# EAGLE board OSSIComms (EAGLE 6.1)
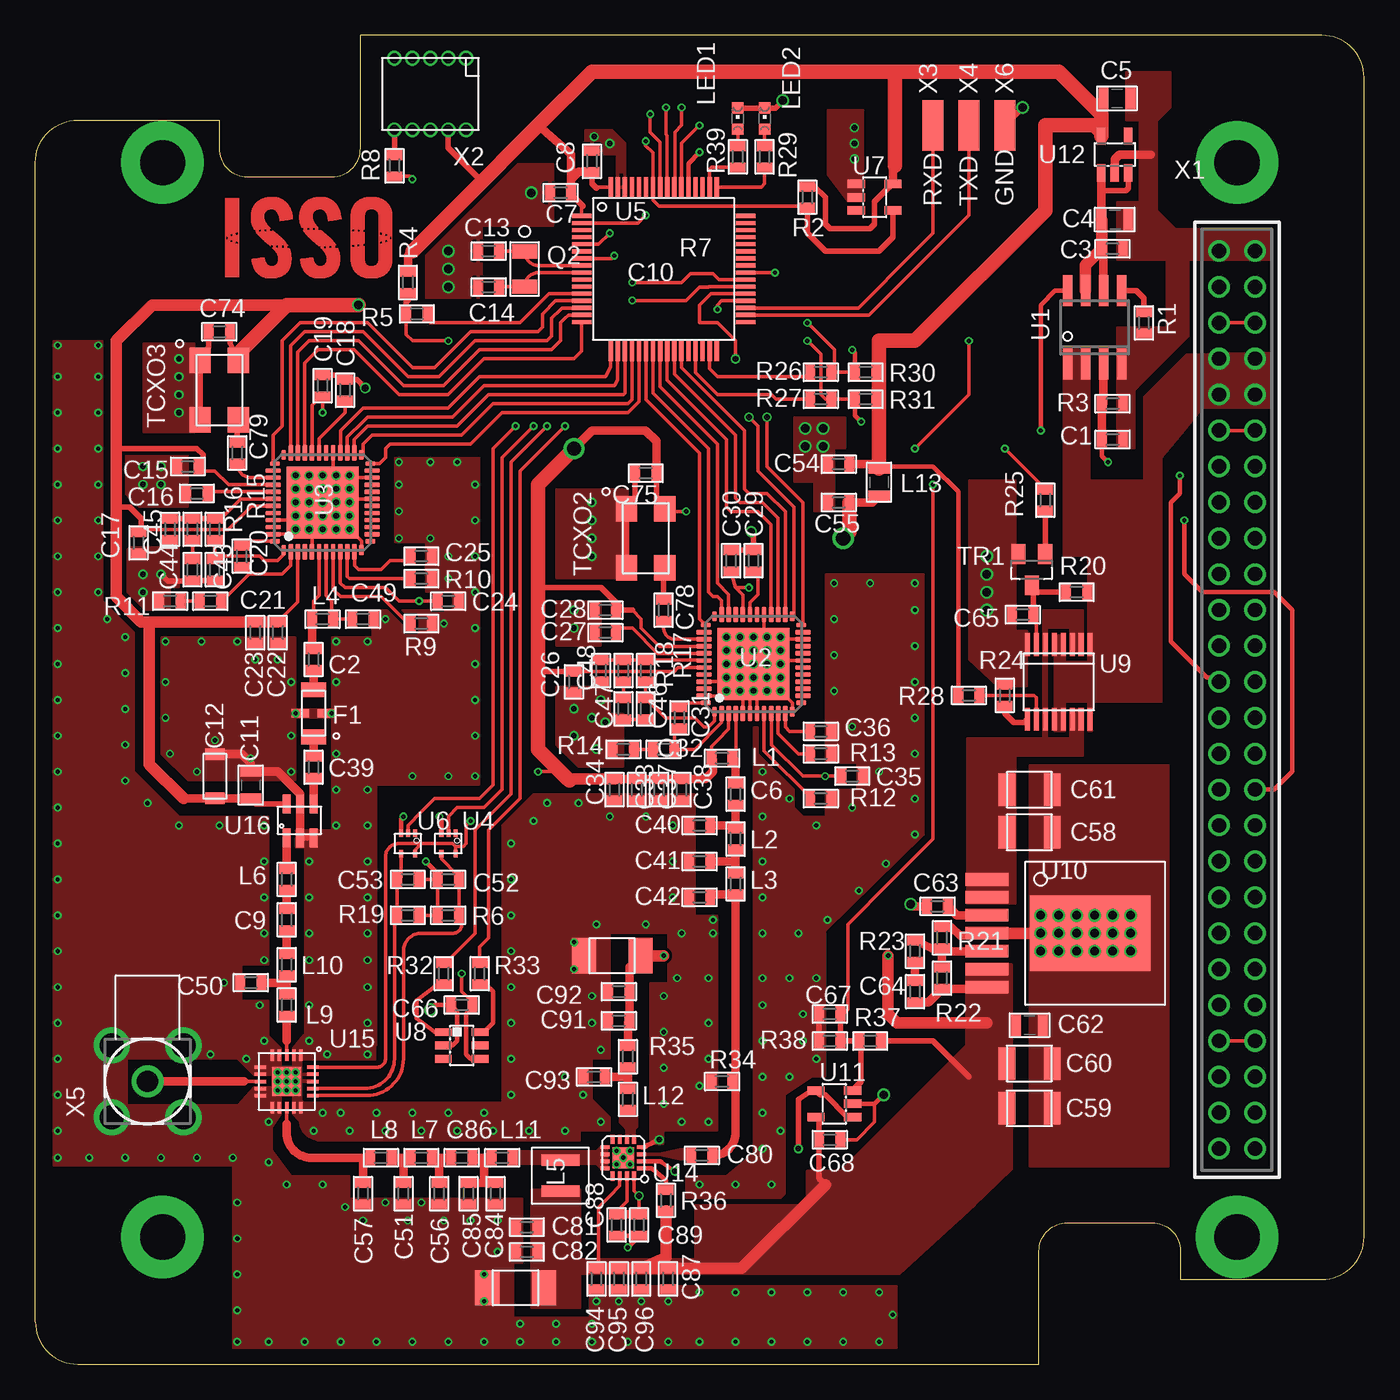
[diagram p4: board, top side]
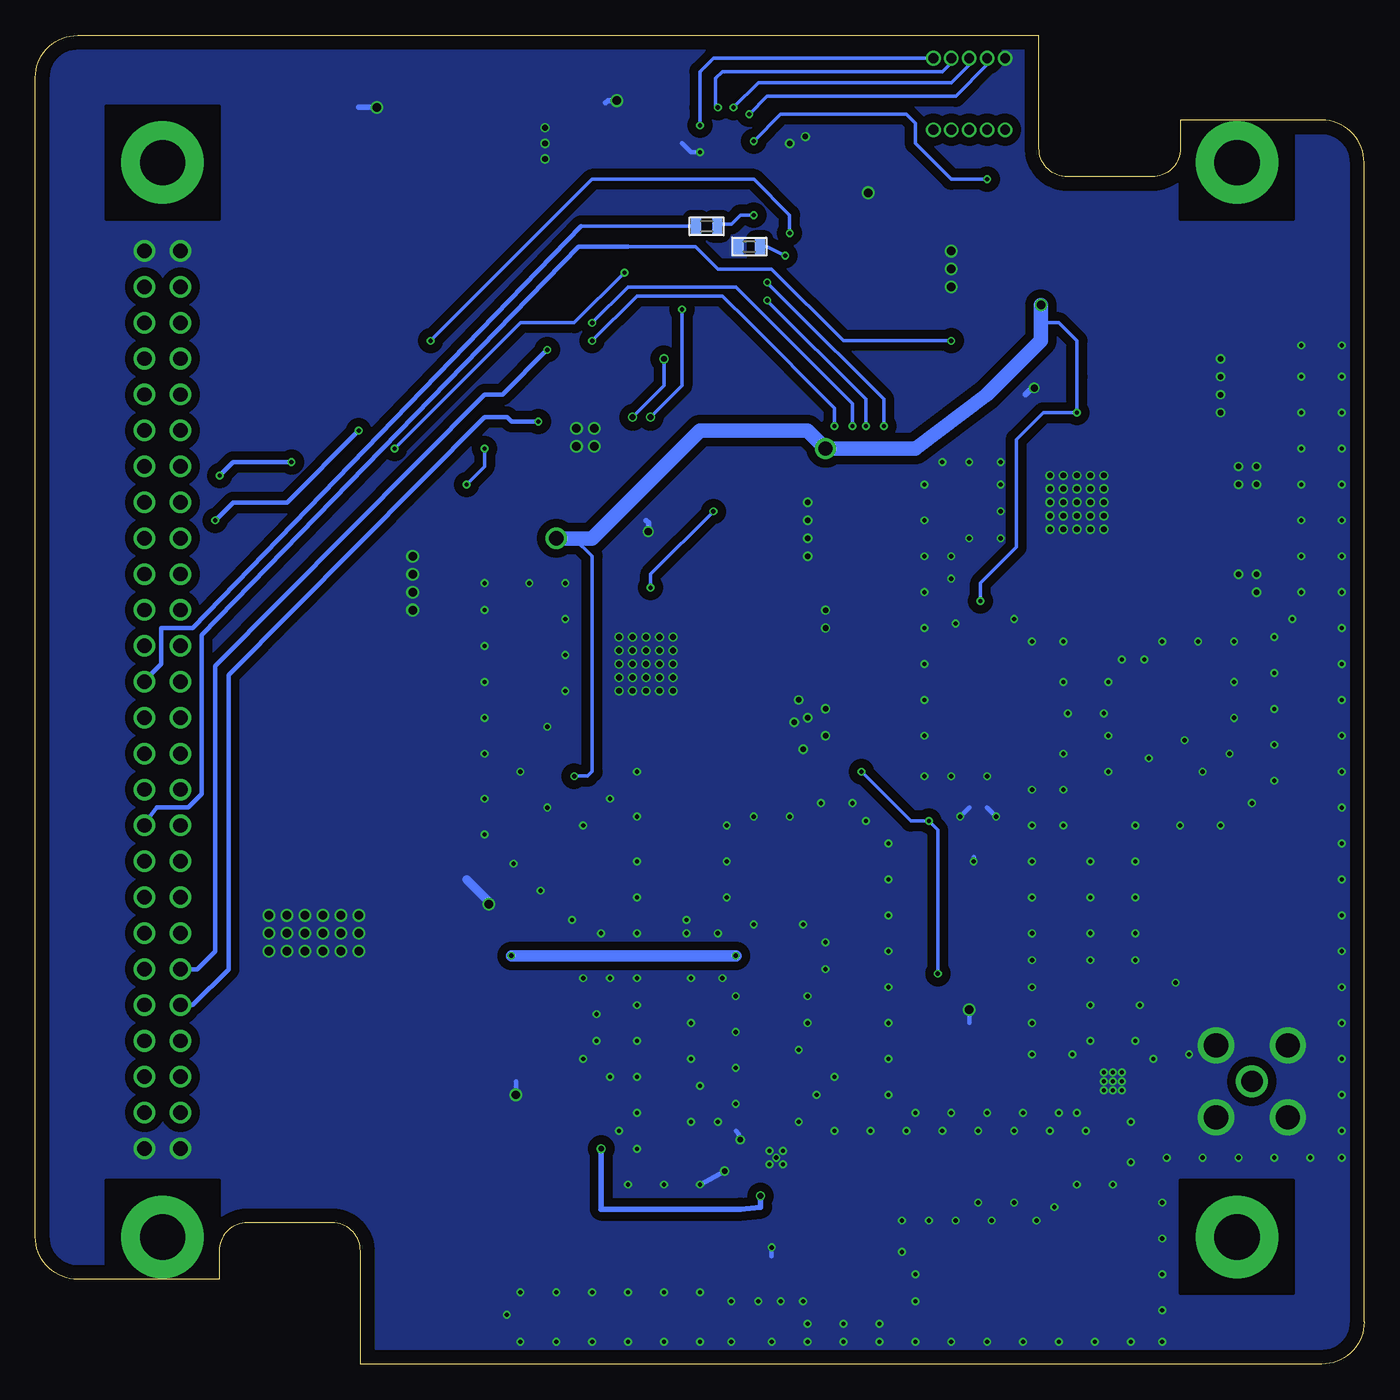
[diagram p5: board, bottom side, seen from below]

Size 94 x 94 mm. Coordinates in mm from the lower left corner, seen from the top.
Outline: 0,3 0,85 arc-90 3,88 13,88 13,86 arc90 15,84 21,84 arc90 23,86 23,94 91,94 arc-90 94,91 94,9 arc-90 91,6 81,6 81,8 arc90 79,10 73,10 arc90 71,8 71,0 3,0 arc-90 0,3
Copper layers (1*16): Top 0.035mm / dielectric 1.5mm / Bottom 0.035mm
Design rules: minimum track width 10mil, minimum drill 5mil, track to track 8mil, track to pad 8mil, pad to pad 8mil, via to via 8mil, smd to smd 8mil, copper to edge 40mil, drill to drill 8mil, minimum pad ring 5mil, minimum via ring 5mil, stop-mask expansion 4mil, vias tented up to drill 0mil, thermal gap 10mil

## Footprints (pad centres in the part's own frame; a part is rotated, then mirrored left to right if it is on the bottom)
C0603(1608) = smd 0.7 x 1.1: 1 -0.75,0; 2 0.75,0
C0805(2012) = smd 0.7 x 1.5: 1 -0.95,0; 2 0.95,0
C1206-GCM31 = smd 0.8 x 1.4: P$1 -1.55,0; P$2 1.55,0
C1210-GCM32 = smd 1.2 x 2.3: P$1 -1.6,0; P$2 1.6,0
C1210-TMK325 = smd 1.7 x 2.5: P$1 -2,0; P$2 2,0
LFCN = smd 1.045 x 1.8: 1 -1.675,0; 3 1.675,0 | smd 0.61 x 1.25: 2 0,-0.925; 4 0,0.925
3.2-PAD-ROUND = drill 3.2 pad 5.842: B3,2 0,0
L0603(1608) = smd 0.7 x 1.1: 1 -0.75,0; 2 0.75,0
NR3012 = smd 0.8 x 2.7: P$1 -1.1,0; P$2 1.1,0
L0805(2012) = smd 0.7 x 1.5: 1 -0.95,0; 2 0.95,0
CHIPLED_0603 = smd 0.8 x 0.8: A 0,-0.75; C 0,0.75
NX-3215 = smd 1 x 1.8: 1 -1.25,0; 2 1.25,0
R0603(1608) = smd 0.7 x 1.1: 1 -0.75,0; 2 0.75,0
TCXO_M532 = smd 1.8 x 1.5: 1 -2.1,-1.35; 2 2.1,-1.35; 3 2.1,1.35; 4 -2.1,1.35
SOT23 = smd 1 x 1.4: 1 -0.95,-1.1; 2 0.95,-1.1; 3 0,1.1
SO8 = smd 0.65 x 2.2: 1 -1.905,-2.6; 2 -0.635,-2.6; 3 0.635,-2.6; 4 1.905,-2.6; 5 1.905,2.6; 6 0.635,2.6; 7 -0.635,2.6; 8 -1.905,2.6
LFCSP48 = smd 0.7 x 0.32: 1 -3.375,2.75; 12 -3.375,-2.75; 25 3.375,-2.75; 36 3.375,2.75 | smd 1.1 x 0.32: 2 -3.5,2.25; 3 -3.5,1.75; 4 -3.5,1.25; 5 -3.5,0.75; 6 -3.5,0.25; 7 -3.5,-0.25; 8 -3.5,-0.75; 9 -3.5,-1.25; 10 -3.5,-1.75; 11 -3.5,-2.25; 26 3.5,-2.25; 27 3.5,-1.75; 28 3.5,-1.25; 29 3.5,-0.75; 30 3.5,-0.25; 31 3.5,0.25; 32 3.5,0.75; 33 3.5,1.25; 34 3.5,1.75; 35 3.5,2.25 | smd 0.32 x 0.7: 13 -2.75,-3.375; 24 2.75,-3.375; 37 2.75,3.375; 48 -2.75,3.375 | smd 0.32 x 1.1: 14 -2.25,-3.5; 15 -1.75,-3.5; 16 -1.25,-3.5; 17 -0.75,-3.5; 18 -0.25,-3.5; 19 0.25,-3.5; 20 0.75,-3.5; 21 1.25,-3.5; 22 1.75,-3.5; 23 2.25,-3.5; 38 2.25,3.5; 39 1.75,3.5; 40 1.25,3.5; 41 0.75,3.5; 42 0.25,3.5; 43 -0.25,3.5; 44 -0.75,3.5; 45 -1.25,3.5; 46 -1.75,3.5; 47 -2.25,3.5 | smd 5.1 x 5.1: EXP 0,0
SOT-553 = smd 0.3 x 0.55: 1 -0.515,-0.725; 2 -0.015,-0.725; 3 0.485,-0.725; 4 0.485,0.725; 5 -0.515,0.725
PM/PAG64 = smd 1.4 x 0.3: 1 -5.8,3.75; 2 -5.8,3.25; 3 -5.8,2.75; 4 -5.8,2.25; 5 -5.8,1.75; 6 -5.8,1.25; 7 -5.8,0.75; 8 -5.8,0.25; 9 -5.8,-0.25; 10 -5.8,-0.75; 11 -5.8,-1.25; 12 -5.8,-1.75; 13 -5.8,-2.25; 14 -5.8,-2.75; 15 -5.8,-3.25; 16 -5.8,-3.75; 33 5.8,-3.75; 34 5.8,-3.25; 35 5.8,-2.75; 36 5.8,-2.25; 37 5.8,-1.75; 38 5.8,-1.25; 39 5.8,-0.75; 40 5.8,-0.25; 41 5.8,0.25; 42 5.8,0.75; 43 5.8,1.25; 44 5.8,1.75; 45 5.8,2.25; 46 5.8,2.75; 47 5.8,3.25; 48 5.8,3.75 | smd 0.3 x 1.4: 17 -3.75,-5.8; 18 -3.25,-5.8; 19 -2.75,-5.8; 20 -2.25,-5.8; 21 -1.75,-5.8; 22 -1.25,-5.8; 23 -0.75,-5.8; 24 -0.25,-5.8; 25 0.25,-5.8; 26 0.75,-5.8; 27 1.25,-5.8; 28 1.75,-5.8; 29 2.25,-5.8; 30 2.75,-5.8; 31 3.25,-5.8; 32 3.75,-5.8; 49 3.75,5.8; 50 3.25,5.8; 51 2.75,5.8; 52 2.25,5.8; 53 1.75,5.8; 54 1.25,5.8; 55 0.75,5.8; 56 0.25,5.8; 57 -0.25,5.8; 58 -0.75,5.8; 59 -1.25,5.8; 60 -1.75,5.8; 61 -2.25,5.8; 62 -2.75,5.8; 63 -3.25,5.8; 64 -3.75,5.8
SOT23-5DBV = smd 0.6 x 1.22: 1 -0.95,-1.3; 2 0,-1.3; 3 0.95,-1.3; 4 0.95,1.3; 5 -0.95,1.3
SOT23-6DBV = smd 0.55 x 1.2: 1 -0.95,-1.3; 2 0,-1.3; 3 0.95,-1.3; 4 0.95,1.3; 5 0,1.3; 6 -0.95,1.3
16QSOP = smd 1.6 x 0.356: 1 -2.65,2.223; 2 -2.65,1.587; 3 -2.65,0.953; 4 -2.65,0.318; 5 -2.65,-0.318; 6 -2.65,-0.953; 7 -2.65,-1.587; 8 -2.65,-2.223; 9 2.65,-2.223; 10 2.65,-1.587; 11 2.65,-0.953; 12 2.65,-0.318; 13 2.65,0.318; 14 2.65,0.953; 15 2.65,1.587; 16 2.65,2.223
TO-PMOD-7 = smd 0.89 x 3.06: 1 -3.81,0; 2 -2.54,0; 3 -1.27,0; 4 0,0; 5 1.27,0; 6 2.54,0; 7 3.81,0 | smd 5.35 x 8.54: PAD 0,7.305
RF5110G = smd 0.64 x 0.28: 1 -1.3,0.75; 2 -1.3,0.25; 3 -1.3,-0.25; 4 -1.3,-0.75; 9 1.3,-0.75; 10 1.3,-0.25; 11 1.3,0.25; 12 1.3,0.75 | smd 0.28 x 0.64: 5 -0.75,-1.3; 6 -0.25,-1.3; 7 0.25,-1.3; 8 0.75,-1.3; 13 0.75,1.3; 14 0.25,1.3; 15 -0.25,1.3; 16 -0.75,1.3 | smd 1.5 x 1.5: TPAD 0,0
DG983-1 = smd 0.81 x 0.25: 1 -1.85,1; 2 -1.85,0.5; 3 -1.85,0; 4 -1.85,-0.5; 5 -1.85,-1; 11 1.85,-1; 12 1.85,-0.5; 13 1.85,0; 14 1.85,0.5; 15 1.85,1 | smd 0.25 x 0.81: 6 -1,-1.85; 7 -0.5,-1.85; 8 0,-1.85; 9 0.5,-1.85; 10 1,-1.85; 16 1,1.85; 17 0.5,1.85; 18 0,1.85; 19 -0.5,1.85; 20 -1,1.85 | smd 2.06 x 2.06: PAD 0,0
SOT23-6 = smd 0.56 x 1.33: 1 -0.95,-1.2; 2 0,-1.2; 3 0.95,-1.2; 4 0.95,1.2; 5 0,1.2; 6 -0.95,1.2
ESQ-126-XX-X-D = drill 1.016 pad 1.524: 1 -1.27,31.75; 2 1.27,31.75; 3 -1.27,29.21; 4 1.27,29.21; 5 -1.27,26.67; 6 1.27,26.67; 7 -1.27,24.13; 8 1.27,24.13; 9 -1.27,21.59; 10 1.27,21.59; 11 -1.27,19.05; 12 1.27,19.05; 13 -1.27,16.51; 14 1.27,16.51; 15 -1.27,13.97; 16 1.27,13.97; 17 -1.27,11.43; 18 1.27,11.43; 19 -1.27,8.89; 20 1.27,8.89; 21 -1.27,6.35; 22 1.27,6.35; 23 -1.27,3.81; 24 1.27,3.81; 25 -1.27,1.27; 26 1.27,1.27; 27 -1.27,-1.27; 28 1.27,-1.27; 29 -1.27,-3.81; 30 1.27,-3.81; 31 -1.27,-6.35; 32 1.27,-6.35; 33 -1.27,-8.89; 34 1.27,-8.89; 35 -1.27,-11.43; 36 1.27,-11.43; 37 -1.27,-13.97; 38 1.27,-13.97; 39 -1.27,-16.51; 40 1.27,-16.51; 41 -1.27,-19.05; 42 1.27,-19.05; 43 -1.27,-21.59; 44 1.27,-21.59; 45 -1.27,-24.13; 46 1.27,-24.13; 47 -1.27,-26.67; 48 1.27,-26.67; 49 -1.27,-29.21; 50 1.27,-29.21; 51 -1.27,-31.75; 52 1.27,-31.75
M50-3200545 = drill 0.7 pad 1: 1 -2.54,-2.54; 2 -2.54,2.54; 3 -1.27,-2.54; 4 -1.27,2.54; 5 0,-2.54; 6 0,2.54; 7 1.27,-2.54; 8 1.27,2.54; 9 2.54,-2.54; 10 2.54,2.54
P-PAD-S = smd 3.556 x 1.5: 1 0,0
MCX-R/A = drill 1.5: 1 0,0 | drill 1.7: 2 -2.54,2.54; 3 2.54,2.54; 4 2.54,-2.54; 5 -2.54,-2.54

## Placement (x,y rotation side)
C1  1uF  [C0603(1608)]  76.2,65.41 0 top
C2  13pF  [C0603(1608)]  19.68,49.85 270 top
C3  100nF  [C0603(1608)]  76.2,78.9 0 top
C4  1uF 0805  [C0805(2012)]  76.36,80.96 0 top
C5  1uF 0805  [C0805(2012)]  76.52,89.53 0 top
C6  13pF  [C0603(1608)]  49.53,40.32 270 top
C7  100nF  [C0603(1608)]  37.15,82.87 180 top
C8  100nF  [C0603(1608)]  39.37,85.09 90 top
C9  1500pF  [C0603(1608)]  17.78,31.43 270 top
C10  100nF  [C0603(1608)]  43.5,79.06 180 bottom
C11  470pF 0805  [C0805(2012)]  15.24,40.96 90 top
C12  10uF  [C1206-GCM31]  12.7,41.59 90 top
C13  12.5pF  [C0603(1608)]  32.07,78.74 180 top
C14  12.5pF  [C0603(1608)]  32.07,76.2 180 top
C15  10nF  [C0603(1608)]  10.79,63.5 180 top
C16  100nF  [C0603(1608)]  11.43,61.59 180 top
C17  10nF  [C0603(1608)]  7.3,58.1 270 top
C18  100nF  [C0603(1608)]  21.91,68.9 90 top
C19  10nF  [C0603(1608)]  20.32,69.22 90 top
C20  22nF  [C0603(1608)]  14.61,57.15 270 top
C21  100nF  [C0603(1608)]  12.38,53.98 180 top
C22  100nF  [C0603(1608)]  17.14,51.75 270 top
C23  100pF  [C0603(1608)]  15.56,51.75 270 top
C24  100nF  [C0603(1608)]  29.21,53.98 0 top
C25  100nF  [C0603(1608)]  27.3,57.15 0 top
C26  10nF  [C0603(1608)]  38.1,48.26 270 top
C27  100nF  [C0603(1608)]  40.32,51.75 180 top
C28  10nF  [C0603(1608)]  40.32,53.34 180 top
C29  100nF  [C0603(1608)]  50.8,56.83 90 top
C30  10nF  [C0603(1608)]  49.21,56.83 90 top
C31  22nF  [C0603(1608)]  45.56,45.72 270 top
C32  100nF  [C0603(1608)]  44.45,43.5 180 top
C33  100nF  [C0603(1608)]  42.55,40.64 270 top
C34  100pF  [C0603(1608)]  40.96,40.64 270 top
C35  100nF  [C0603(1608)]  57.78,41.59 0 top
C36  100nF  [C0603(1608)]  55.56,44.77 0 top
C37  100nF  [C0603(1608)]  44.13,40.64 270 top
C38  100pF  [C0603(1608)]  45.72,40.64 270 top
C39  15pF  [C0603(1608)]  19.68,42.23 270 top
C40  8.2pF  [C0603(1608)]  46.99,38.1 180 top
C41  12pF  [C0603(1608)]  46.99,35.56 180 top
C42  8.2pF  [C0603(1608)]  46.99,33.02 180 top
C43  1.2nF  [C0603(1608)]  12.7,56.2 270 top
C44  100nF  [C0603(1608)]  11.11,56.2 270 top
C45  10nF  [C0603(1608)]  9.53,59.05 270 top
C46  1.2nF  [C0603(1608)]  43.18,46.35 270 top
C47  100nF  [C0603(1608)]  41.59,46.35 270 top
C48  10nF  [C0603(1608)]  40.01,49.05 270 top
C49  6.8pF  [C0603(1608)]  23.18,52.7 0 top
C50  DNP  [C0603(1608)]  15.24,26.99 180 top
C51  DNP  [C0603(1608)]  26.04,12.06 90 top
C52  100pF  [C0603(1608)]  29.21,34.29 180 top
C53  100pF  [C0603(1608)]  26.35,34.29 0 top
C54  10nF  [C0603(1608)]  56.83,63.66 180 top
C55  100nF  [C0603(1608)]  56.83,60.96 180 top
C56  DNP  [C0603(1608)]  28.57,12.06 90 top
C57  DNP  [C0603(1608)]  23.18,12.06 90 top
C58  [C1210-GCM32]  70.33,37.62 0 top
C59  [C1210-GCM32]  70.33,18.1 0 top
C60  [C1210-GCM32]  70.33,21.27 0 top
C61  [C1210-GCM32]  70.33,40.64 0 top
C62  [C0805(2012)]  70.33,23.97 0 top
C63  10nF  [C0603(1608)]  63.82,32.38 180 top
C64  180pF  [C0603(1608)]  62.23,26.35 90 top
C65  100nF  [C0603(1608)]  69.85,53.02 180 top
C66  100nF  [C0603(1608)]  30.16,25.4 180 top
C67  100nF  [C0603(1608)]  56.2,24.77 180 top
C68  100nF  [C0603(1608)]  56.2,15.88 0 top
C74  10nF  [C0603(1608)]  13.02,73.03 180 top
C75  10nF  [C0603(1608)]  43.18,63.02 180 top
C78  22pF  [C0603(1608)]  44.45,53.34 270 top
C79  22pF  [C0603(1608)]  14.29,64.45 270 top
C80  8.2pF  [C0603(1608)]  47.15,14.76 180 top
C81  47pF  [C0603(1608)]  34.77,9.68 180 top
C82  1nF  [C0603(1608)]  34.77,7.94 180 top
C83  3.3uF  [C1210-TMK325]  33.97,5.4 180 top
C84  22pF  [C0603(1608)]  32.54,12.06 270 top
C85  2pF  [C0603(1608)]  30.64,12.06 270 top
C86  56pF  [C0603(1608)]  30.16,14.61 180 top
C87  10nF  [C0603(1608)]  44.77,6.03 90 top
C88  10nF  [C0603(1608)]  41.12,9.84 90 top
C89  10nF  [C0603(1608)]  42.7,9.84 90 top
C90  3.3uF  [C1210-TMK325]  40.8,28.89 180 top
C91  1nF  [C0603(1608)]  41.27,24.29 180 top
C92  10pF  [C0603(1608)]  41.27,26.35 180 top
C93  15pF  [C0603(1608)]  39.53,20.32 180 top
C94  330pF  [C0603(1608)]  39.69,6.03 270 top
C95  1nF  [C0603(1608)]  41.27,6.03 270 top
C96  10nF  [C0603(1608)]  42.86,6.03 270 top
F1  LFCN-160  [LFCN]  19.68,46.04 90 top
H1  MOUNT-PAD-ROUND3.2  [3.2-PAD-ROUND]  9,9 0 top
H2  MOUNT-PAD-ROUND3.2  [3.2-PAD-ROUND]  9,85 0 top
H3  MOUNT-PAD-ROUND3.2  [3.2-PAD-ROUND]  85,9 0 top
H4  MOUNT-PAD-ROUND3.2  [3.2-PAD-ROUND]  85,85 0 top
L1  26nH  [L0603(1608)]  48.58,42.86 180 top
L2  11nH  [L0603(1608)]  49.53,37.15 270 top
L3  11nH  [L0603(1608)]  49.53,33.97 270 top
L4  27nH  [L0603(1608)]  20.32,52.7 180 top
L5  39nH 3012, 1A rating  [NR3012]  37.15,13.34 270 top
L6  47nH  [L0603(1608)]  17.78,34.29 270 top
L7  [L0603(1608)]  27.3,14.61 180 top
L8  [L0603(1608)]  24.45,14.61 180 top
L9  [L0603(1608)]  17.78,25.4 270 top
L10  [L0603(1608)]  17.78,28.26 270 top
L11  3.9nH  [L0603(1608)]  33.02,14.61 180 top
L12  1.5nH  [L0603(1608)]  41.91,18.73 270 top
L13  0 Ohm  [L0805(2012)]  59.69,62.39 270 top
LED1  [CHIPLED_0603]  49.69,88.11 0 top
LED2  [CHIPLED_0603]  51.59,88.11 0 top
Q2  NX-3215  [NX-3215]  34.61,77.47 270 top
R1  TBD  [R0603(1608)]  78.42,73.66 90 top
R2  100k  [R0603(1608)]  54.61,82.55 90 top
R3  100k  [R0603(1608)]  76.2,67.94 180 top
R4  470k  [R0603(1608)]  26.35,76.52 90 top
R5  4.7k  [R0603(1608)]  26.99,74.3 180 top
R6  10k  [R0603(1608)]  29.21,31.75 0 top
R7  1.5k  [R0603(1608)]  46.51,80.49 180 bottom
R8  4.7k  [R0603(1608)]  25.4,84.77 270 top
R9  1.1k  [R0603(1608)]  27.3,52.39 0 top
R10  3.6k  [R0603(1608)]  27.3,55.56 0 top
R11  3.9  [R0603(1608)]  9.53,53.98 0 top
R12  1.1k  [R0603(1608)]  55.56,40.01 180 top
R13  3.6k  [R0603(1608)]  55.56,43.18 180 top
R14  3.9  [R0603(1608)]  41.59,43.5 0 top
R15  280  [R0603(1608)]  12.7,59.05 90 top
R16  100  [R0603(1608)]  11.11,59.05 90 top
R17  280  [R0603(1608)]  43.18,49.05 90 top
R18  100  [R0603(1608)]  41.59,49.05 90 top
R19  10k  [R0603(1608)]  26.35,31.75 180 top
R20  100k  [R0603(1608)]  73.66,54.61 0 top
R21  23.7k  [R0603(1608)]  64.14,30.16 90 top
R22  75k  [R0603(1608)]  64.14,27.3 90 top
R23  1.1k  [R0603(1608)]  62.23,29.21 90 top
R24  TBD  [R0603(1608)]  68.58,47.31 270 top
R25  1.5k  [R0603(1608)]  71.44,61.12 90 top
R26  250  [R0603(1608)]  55.56,70.17 180 top
R27  250  [R0603(1608)]  55.56,68.26 180 top
R28  100k  [R0603(1608)]  66.04,47.31 0 top
R29  1k  [R0603(1608)]  51.59,85.41 90 top
R30  10k  [R0603(1608)]  58.74,70.17 0 top
R31  10k  [R0603(1608)]  58.74,68.26 0 top
R32  250  [R0603(1608)]  28.89,27.62 270 top
R33  250  [R0603(1608)]  31.43,27.62 270 top
R34  180  [R0603(1608)]  48.58,20 0 top
R35  330nH  [R0603(1608)]  41.91,21.75 270 top
R36  11nH  [R0603(1608)]  44.61,11.59 270 top
R37  22k  [R0603(1608)]  59.05,22.86 180 top
R38  100k  [R0603(1608)]  56.2,22.86 180 top
R39  1k  [R0603(1608)]  49.69,85.41 90 top
TCXO2  19.2MHz  [TCXO_M532]  43.18,58.42 270 top
TCXO3  19.2MHz  [TCXO_M532]  13.02,68.9 270 top
TR1  FDV301N  [SOT23]  70.48,56.2 180 top
U1  MAX890L  [SO8]  74.93,73.34 0 top
U2  ADF7021-N  [LFCSP48]  50.8,49.53 90 top
U3  ADF7021-N  [LFCSP48]  20.32,60.96 90 top
U4  NL17SZ17  [SOT-553]  29.21,36.83 180 top
U5  MSP430F1611  [PM/PAG64]  44.45,77.47 0 top
U6  NL17SZ17  [SOT-553]  26.35,36.83 180 top
U7  TPS3838  [SOT23-5DBV]  59.37,82.55 270 top
U8  TMP101  [SOT23-6DBV]  30.16,22.54 270 top
U9  MAX869L  [16QSOP]  72.39,48.26 270 top
U10  LMZ10503EXT  [TO-PMOD-7]  67.31,30.48 270 top
U11  OPA347  [SOT23-5DBV]  56.52,18.41 90 top
U12  TPS73233  [SOT23-5DBV]  76.36,85.57 0 top
U14  RF5110G  [RF5110G]  41.59,14.61 180 top
U15  HSWA2-30DR+  [DG983-1]  17.78,20 270 top
U16  MAX2640  [SOT23-6]  18.73,38.42 0 top
U$1  OSSILOGORECT  [OSSILOGORECT1005]  25.24,82.55 180 top
X1  ESQ-126-38-G-D  [ESQ-126-XX-X-D]  85,47 0 top
X2  JTAG10PINMINI-H  [M50-3200545]  27.94,89.85 180 top
X3  P-PAD-S  [P-PAD-S]  63.5,87.63 90 top
X4  P-PAD-S  [P-PAD-S]  66.04,87.63 90 top
X5  RFCON-MCX-R/A  [MCX-R/A]  7.94,20 90 top
X6  P-PAD-S  [P-PAD-S]  68.58,87.63 90 top

## Tracks (layer width: path | path; a pad name or v marks a point on that pad's centre or on a via)
3.3VCOMMS
  Top 0.254: R30.2 59.49,70.05 59.69,69.85 | R31.2 59.49,68.38 59.69,68.58 | U5.1 38.65,81.83 38.73,81.92 | U5.64 39.77,83.27 39.69,83.19
  Top 0.305: R28.1 65.29,61.71 63.5,63.5 59.85,63.5 L13.1
  Top 0.406: C7.1 37.9,82.75 38.73,81.92 | C8.1 39.37,83.5 39.69,83.19 | X2.4 29.21,86.04 31.59,83.66 | R2.2 55.13,83.3 55.88,82.55 55.88,80.64 56.2,80.33 59.05,80.33 59.37,80.64 59.37,82.23 60.64,83.5 60.65,83.5 U7.5
  Top 0.61: U12.5 75.41,89.38 C5.1 | C54.1 59.37,63.66 L13.1 | C7.1 37.9,83.82 | 37.9,83.82 37.9,85.61 35.56,87.63 | C8.1 38.42,84.34 37.9,83.82 | R4.2 26.35,78.42 26.67,78.74 | U7.5 60.67,84.64 60.8,84.77
  Top 1.016: 60.8,91.44 72.39,91.44 75.41,88.42 U12.5 75.41,87.15 74.93,87.63 71.44,87.63 71.44,81.6 62.23,72.39 59.69,72.39 59.69,69.85 59.69,68.58 L13.1 | 60.8,91.44 39.37,91.44 35.56,87.63 34.29,86.36 31.59,83.66 26.67,78.74 | 60.8,91.44 60.8,84.77
3.3VOBC
  Top 0.254: X1.45 83.82,22.86 86.36,22.86 X1.46
/RST  (via drill 0.3)
  Top 0.254: R2.1 54.49,81.92 44.13,81.92 43.7,82.35 U5.58 43.7,85.68 43.66,85.72 43.18,86.2 v43.18,86.52 | R8.2 26.47,84.02 v26.67,83.82
  Top 0.406: U7.4 60.67,79.72 59.69,78.74 55.88,78.74 54.61,80.01 R2.1
  Bottom 0.254: v26.67,83.82 29.21,83.82 31.75,86.36 31.75,87.79 32.38,88.42 41.27,88.42 v43.18,86.52
COMMS_-FAULT  (via drill 0.3)
  Top 0.305: U1.8 72.13,75.94 71.12,74.93 v71.12,66.04 | v81.28,59.69 81.28,55.88 82.55,54.61 87.63,54.61 88.9,53.34 88.9,41.91 87.63,40.64 X1.32
  Bottom 0.305: v71.12,66.04 76.2,60.96 80.01,60.96 v81.28,59.69
COMMS_OFF  (via drill 0.3)
  Top 0.254: 75.56,67.94 R3.2
  Top 0.305: C1.1 75.45,64.25 v75.88,63.82 | v80.96,62.87 80.96,61.59 80.33,60.96 80.33,51.12 82.87,48.58 83.5,48.58 83.82,48.26 83.81,48.27 X1.25
  Top 0.61: U1.3 75.56,67.94 | R3.2 C1.1
  Bottom 0.305: v75.88,63.82 80.01,63.82 v80.96,62.87
COMMS_SCL  (via drill 0.3)
  Top 0.254: 56.52,70.17 R26.1 56.52,70.17 | 56.52,70.17 R30.1 | R32.1 29.01,28.37 31.11,30.48 31.11,37.78 33.66,40.32 33.66,63.82 v36.2,66.36 | v54.61,73.66 56.52,71.75 56.52,71.44 56.52,70.17
  Top 0.305: R30.1 57.99,71.55 v57.78,71.75
  Bottom 0.254: v36.2,66.36 36.2,67.94 42.55,74.3 44.45,76.2 52.07,76.2 v54.61,73.66
  Bottom 0.305: v57.78,71.75 60.96,68.58 62.23,68.58 81.28,49.37 81.28,29.21 82.55,27.94 X1.41
COMMS_SDA  (via drill 0.3)
  Top 0.254: R31.1 R27.1 55.88,68.26 55.56,68.58 55.56,71.44 v54.61,72.39 | R33.1 31.43,29.53 32.07,30.16 32.07,37.78 34.29,40.01 34.29,63.18 v37.47,66.36
  Top 0.305: R31.1 57.99,67.11 v58.42,66.67
  Bottom 0.254: v37.47,66.36 37.47,67.63 43.5,73.66 45.4,75.56 51.44,75.56 v54.61,72.39
  Bottom 0.305: v58.42,66.67 60.33,66.67 60.64,66.99 61.91,66.99 62.23,66.99 80.33,48.74 80.33,27.94 82.86,25.41 X1.43
COMMSRX_CE
  Top 0.254: U5.21 42.7,68.1 41.91,67.31 33.02,67.31 30.8,65.09 30.48,65.09 25.08,65.09 24.77,64.77 24.77,64.14 24.34,63.71 U3.24
COMMSRX_CLK
  Top 0.254: U3.35 18.07,72.05 19.05,73.03 23.18,73.03 26.35,69.85 28.57,69.85 31.11,72.39 36.2,72.39 36.51,72.71 36.51,73.98 37.15,74.61 37.26,74.72 U5.14
COMMSRX_CPOUT
  Top 0.254: R15.2 13.13,59.8 14.29,60.96 14.54,61.21 U3.42
  Top 0.406: R15.2 R16.2 C45.1
COMMSRX_DATA
  Top 0.254: U3.34 18.57,71.59 19.37,72.39 19.68,72.39 22.86,72.39 26.04,69.22 28.89,69.22 31.11,71.44 31.43,71.75 36.51,71.75 37.15,72.39 37.15,73.66 37.47,73.98 37.71,74.22 U5.15
COMMSRX_MUXOUT
  Top 0.254: U5.13 36.8,75.22 35.88,74.3 35.88,73.34 35.56,73.03 30.8,73.03 28.26,70.48 26.67,70.48 23.5,73.66 18.73,73.66 17.46,72.39 17.46,66.36 17.14,66.04 16.83,65.72 16.83,63.83 U3.37
COMMSRX_RFIN
  Top 0.254: U3.6 20.07,54.36 19.68,53.98 19.68,52.82 L4.2
  Top 0.406: 19.57,50.71 C2.1
  Top 0.61: L4.2 19.57,50.71
COMMSRX_RFINB
  Top 0.254: U3.7 20.57,54.36 20.64,54.29 20.95,53.98 20.95,52.82 L4.1 C49.1
COMMSRX_SCLK
  Top 0.254: U5.17 40.7,70.55 40.32,69.85 31.43,69.85 29.21,67.63 23.18,67.63 21.59,66.04 21.59,64.45 21.58,64.46 U3.28
COMMSRX_SDATA
  Top 0.254: U5.19 41.7,68.69 41.59,68.58 32.07,68.58 29.84,66.36 23.5,66.36 22.54,65.41 22.54,64.49 U3.26
COMMSRX_SLE
  Top 0.254: U5.20 42.2,68.23 41.91,67.94 32.38,67.94 30.16,65.72 23.81,65.72 23.18,65.09 23.19,64.45 U3.25
COMMSRX_SREAD
  Top 0.254: U3.27 22.07,65.57 23.18,66.67 23.5,66.99 29.53,66.99 31.75,69.22 40.32,69.22 40.64,69.22 40.96,69.22 41.2,69.61 U5.18
COMMSRX_SWD
  Top 0.254: U5.16 38.65,71.67 38.1,71.12 31.75,71.12 29.21,68.58 25.72,68.58 22.54,71.75 20,71.75 19.05,70.8 19.05,67.63 19.05,66.99 19.05,64.45 19.06,64.46 U3.33
COMMSRX_TCXO
  Top 0.254: U3.39 15.28,62.71 arc-90 C79.2
COMMSRX_VCOIN
  Top 0.254: R15.1 C43.1 12.9,57.15 15.88,57.15 16.19,56.83 17.14,56.83 17.57,57.26 U3.1
COMMSTX_CE  (via drill 0.4)
  Top 0.254: v51.75,66.99 51.75,63.5 54.29,60.96 54.29,53.98 54.29,53.34 54.29,52.4 U2.24 | U5.37 47.78,75.72 46.99,74.93 46.99,73.66 48.26,73.66 49.53,72.39 v49.53,71.12
  Bottom 0.254: v49.53,71.12 49.53,69.22 v51.75,66.99
COMMSTX_CLK
  Top 0.254: U2.35 48.55,54 48.26,54.29 47.94,54.29 47.62,54.61 47.62,64.77 43.7,68.69 U5.23
COMMSTX_CPOUT
  Top 0.254: C48.1 R18.2 R17.2 47.28,49.8 U2.42
COMMSTX_DATA
  Top 0.254: U2.34 49.05,54.45 48.26,55.24 48.26,65.09 44.2,69.15 U5.24
COMMSTX_MUXOUT
  Top 0.254: U5.22 43.2,68.24 46.99,64.45 46.99,52.72 U2.37
COMMSTX_RFOUT
  Top 0.254: U2.4 49.55,43.09 L1.1
  Top 0.406: 49.53,42.66 L1.1
  Top 0.61: C6.1 49.53,42.66
COMMSTX_SCLK
  Top 0.254: U2.28 52.05,59.39 51.12,60.33 49.21,60.33 48.9,60.64 48.9,65.41 44.7,69.6 U5.25
COMMSTX_SDATA
  Top 0.254: U2.26 53.05,60.3 51.75,61.59 50.48,61.59 50.16,61.91 50.16,66.04 45.7,70.5 U5.27
COMMSTX_SLE  (via drill 0.3, 0.4)
  Top 0.254: U5.36 48.55,75.22 48.26,74.93 v48.26,74.61 | v50.48,66.99 51.12,66.36 51.12,63.18 51.44,62.87 51.75,62.55 53.66,60.64 53.66,53.01 U2.25
  Bottom 0.254: v48.26,74.61 48.26,69.22 v50.48,66.99
COMMSTX_SREAD
  Top 0.254: U2.27 52.55,59.84 51.44,60.96 49.85,60.96 49.53,61.28 49.53,65.72 45.2,70.05 U5.26
COMMSTX_TCXO
  Top 0.254: U2.39 45.24,51.28 arc-90 44.45,52.07 44.45,52.55 C78.2
COMMSTX_VCOIN
  Top 0.254: 43.18,48.26 R17.1 43.18,48.26 | 43.18,48.26 C46.1 | C46.1 43.18,48.26 | U2.1 48.05,45.51 47.62,45.09 47.31,45.09 46.67,45.72 44.56,45.72 C46.1
GND  (via drill 0.3, 0.4, 0.5, 0.6)
  Top 0.1: 18.73,40.32 U16.5
  Top 0.254: U2.47 48.55,47.28 49.53,48.26 v49.85,48.58 49.55,48.28 U2.45 50.78,48.28 50.8,48.26 51.05,48.01 U2.7 | U2.5 50.05,47.42 v49.85,47.62 | U2.6 50.55,47.38 v50.8,47.62 | v50.8,48.58 U2.EXP | U2.12 53.55,46.78 53.34,46.99 v52.7,47.62 | U2.22 52.55,51.28 | 52.55,51.28 52.07,50.8 | U2.19 52,49.78 v51.75,49.53 | U2.29 51.55,51.64 v51.75,51.44 | U3.47 18.07,58.71 19.05,59.69 v19.37,60.01 19.07,59.71 U3.45 | U3.5 19.57,58.85 v19.37,59.05 | U3.12 23.07,58.21 v22.23,59.05 | U3.22 22.07,62.71 21.59,62.23 v21.27,61.91 21.07,62.12 U3.29 | U3.19 21.52,61.21 v21.27,60.96 | R19.1 R6.1 C52.2 C53.2 | C46.2 41.8,45.6 41.59,45.4 | C47.2 41.59,45.4 | 41.59,45.4 41.59,45.72 | C68.2 58.1,15.88 59.37,17.14 59.37,18.41 U11.2 | 52.55,51.28 52.07,50.8 | 52.07,50.8 v51.75,50.48 | C44.2 11.43,55.45
  Top 0.305: U14.4 43.03,15.36 arc45 43.21,15.43 v44.13,15.88 | U14.2 44.12,14.36 arc-45 44.3,14.28 v45.24,13.65 | U11.2 59.37,18.41 v60.01,19.05 | U6.3 25.87,38.57 v26.04,38.73 | U4.3 28.73,38.59 v28.57,38.73 | C52.2 28.46,34.72 v27.62,35.56 | U5.53 46.2,84.94 v46.99,85.72 | U8.2 29.53,22.54 29.84,22.86 29.84,24.97 C66.2 28.26,25.4 v27.94,25.08 | C88.1 42.66,9.09 42.55,8.89 42.7,9.05 | 42.7,9.05 C89.1 42.7,9.05 | 42.7,9.05 v41.91,8.26
  Top 0.406: C74.2 12.27,71.96 11.43,71.12 | TCXO3.1 11.67,71.36 11.43,71.12 | TCXO3.2 11.67,70.88 11.43,71.12 | U16.2 U16.3 | C43.2 11.43,55.45 11.16,55.45 11.11,55.4 9.37,55.4 v8.89,55.88 | C19.2 21.59,69.97 C18.2 22.75,69.65 v23.34,69.06 | C30.2 C29.2 50.8,58.74 v50.64,58.9 | C67.2 R38.2 | C75.2 42.43,61.12 TCXO2.1 TCXO2.2 | LED1.C LED2.C 52.34,88.86 v52.86,89.38 | X6.1 v69.85,88.9
  Top 0.6: U16.2 U16.5 18.73,40.32 18.41,40.64 17.14,41.91 C11.2 15.24,42.55 14.61,43.18 12.74,43.18 C12.P$2
  Top 0.61: U12.2 76.36,85.25 76.68,85.57 78.9,85.57 | R21.2 64.81,30.91 65.41,30.32 67.15,30.32 U10.4 | C63.2 62.07,32.38 v61.91,32.54
  Top 0.813: U10.4 v71.12,30.48 v73.66,30.48
  Bottom 0.305: v44.13,15.88 44.19,15.88 arc45 44.21,16.27 44.45,16.51 | v45.24,13.65 v46.99,12.7 | v60.01,19.05 60.01,20 | v26.04,38.73 26.67,39.37 | v28.57,38.73 27.94,39.37 | v27.62,35.56 27.62,35.88 | v46.99,85.72 47.62,85.72 48.26,86.36 | v27.94,25.08 27.94,24.13 | v41.91,8.26 41.91,7.62
  Bottom 0.406: v23.34,69.06 23.5,69.06 23.97,68.58 | v50.64,58.9 50.64,59.53 50.8,59.69 | v52.86,89.38 53.5,89.38 53.66,89.22 | v69.85,88.9 71.12,88.9
  Bottom 0.61: v61.91,32.54 61.91,32.7 63.5,34.29
  other vias: 20.32,60.96 20.32,61.91 20.32,62.87 19.37,62.87 19.37,61.91 19.37,60.96 20.32,60.01 21.27,60.01 21.27,62.87 20.32,59.05 21.27,59.05 18.41,60.01 18.41,60.96 18.41,61.91 18.41,62.87 22.23,62.87 22.23,61.91 22.23,60.96 22.23,60.01 18.41,59.05 50.8,49.53 50.8,50.48 50.8,51.44 51.75,48.58 51.75,47.62 52.7,48.58 52.7,49.53 52.7,50.48 49.85,51.44 49.85,50.48 49.85,49.53 48.9,47.62 48.9,48.58 48.9,49.53 48.9,50.48 48.9,51.44 71.12,31.75 72.39,30.48 71.12,29.21 72.39,29.21 73.66,29.21 73.66,31.75 72.39,31.75 74.93,31.75 74.93,30.48 74.93,29.21 76.2,29.21 76.2,30.48 76.2,31.75 77.47,31.75 77.47,30.48 77.47,29.21 52.7,51.44 7.62,55.88 7.62,54.61 7.62,62.23 7.62,63.5 8.89,63.5 8.89,62.23 10.16,67.31 10.16,68.58 10.16,69.85 10.16,71.12 40.64,86.36 39.53,86.84 57.94,85.25 57.94,86.36 57.94,87.47 29.21,76.2 29.21,78.74 29.21,77.47 35.08,82.87 54.45,66.2 54.45,64.93 55.72,64.93 55.72,66.2 67.31,57.15 67.31,55.88 67.31,54.61 67.31,53.34 41.59,14.61 42.07,15.08 41.12,15.08 41.12,14.13 42.07,14.13 17.78,20 17.78,20.64 17.14,20.64 17.14,20 17.14,19.37 17.78,19.37 18.41,19.37 18.41,20 18.41,20.64 56.52,55.24 56.52,52.7 56.52,50.16 56.52,47.62 57.78,45.09 59.69,41.91 57.78,39.37 55.24,38.1 53.34,40.01 51.44,41.91 51.44,38.73 51.44,35.56 51.44,33.02 51.44,30.48 53.34,27.3 51.44,25.4 51.44,22.86 51.44,20.32 51.44,17.78 51.44,15.24 49.53,12.7 52.07,12.7 52.7,16.51 53.34,20.32 55.24,21.59 55.24,27.3 53.98,30.48 56.04,31.43 58.26,33.5 60.17,35.4 62.23,37.47 62.23,40.01 62.23,43.18 62.23,45.72 62.23,48.26 62.23,50.8 62.23,53.34 62.23,55.24 59.05,55.24 35.24,38.42 36.2,39.69 38.42,39.69 40.64,38.73 43.18,38.73 45.09,38.1 45.09,35.56 45.09,33.02 33.66,36.83 33.66,34.29 33.66,31.75 33.66,29.21 33.66,26.67 33.66,24.13 33.66,21.59 33.66,19.05 31.75,17.78 29.21,17.78 26.67,17.78 24.13,17.78 21.59,17.78 20.32,17.78 19.68,16.51 22.23,16.51 24.77,16.51 27.3,16.51 29.84,16.51 32.38,16.51 34.92,16.51 37.47,16.51 40.01,17.14 38.73,19.05 40.01,22.23 39.37,24.13 39.37,26.04 38.1,27.94 38.1,29.84 43.18,31.11 47.94,31.43 45.72,30.48 44.45,26.04 44.45,23.5 44.45,20.95 44.45,18.41 45.72,17.14 47.62,17.14 47.62,24.13 47.62,21.59 47.62,27.3 45.4,27.3 47.94,30.48 37.47,20.32 46.99,19.68 16.51,17.14 16.51,14.29 17.78,12.7 20.32,12.7 21.91,11.11 23.18,10.16 24.77,11.43 26.35,10.16 27.3,11.43 28.89,10.16 30.8,10.16 32.7,10.16 32.7,7.94 31.75,6.35 31.75,4.45 39.69,4.45 41.27,4.45 42.86,4.45 44.77,4.45 34.29,2.86 36.83,2.86 39.37,2.86 46.99,5.08 52.07,1.59 49.53,5.08 52.07,5.08 54.61,5.08 57.15,5.08 59.69,5.08 60.64,3.49 59.69,1.59 57.15,1.59 54.61,1.59 49.53,1.59 46.99,1.59 44.77,1.59 41.91,1.59 39.37,1.59 36.83,1.59 34.29,1.59 31.75,1.59 29.21,1.59 26.67,1.59 24.13,1.59 21.59,1.59 19.05,1.59 16.51,1.59 14.29,1.59 14.29,3.81 14.29,6.35 14.29,8.89 14.29,11.43 13.97,14.61 11.43,14.61 8.89,14.61 6.35,14.61 3.81,14.61 1.59,14.61 1.59,16.51 1.59,19.05 1.59,21.59 1.59,24.13 1.59,26.67 1.59,29.21 1.59,31.75 1.59,34.29 1.59,36.83 1.59,39.37 1.59,41.91 1.59,44.45 1.59,46.99 1.59,49.53 1.59,52.07 1.59,54.61 1.59,57.15 1.59,59.69 1.59,62.23 1.59,64.77 1.59,67.31 1.59,69.85 1.59,72.07 4.45,72.07 4.45,69.85 4.45,67.31 4.45,64.77 4.45,62.23 4.45,59.69 4.45,57.15 6.35,51.44 6.35,48.9 6.35,46.35 6.35,43.81 6.35,41.27 7.94,39.69 4.45,54.61 5.08,52.7 10.16,38.1 13.02,38.1 16.19,38.1 16.19,35.56 16.19,33.02 16.19,30.48 16.19,28.57 13.34,26.99 15.88,25.4 16.19,22.86 14.92,21.59 12.38,21.91 9.21,51.12 9.21,48.26 9.21,45.72 9.53,43.18 11.43,41.91 12.7,44.13 15.24,42.86 18.1,41.91 18.1,44.45 18.41,46.04 18.1,48.26 15.56,49.85 17.14,49.85 14.29,51.12 11.75,51.12 21.27,51.12 21.27,48.26 20.95,46.04 21.27,43.18 21.27,40.64 21.27,38.1 19.37,35.56 19.37,33.02 19.37,30.48 19.37,28.57 19.37,25.4 19.37,22.86 20.64,21.91 23.5,21.91 23.5,24.13 23.5,26.67 23.5,28.57 23.5,30.48 23.5,33.02 23.5,35.56 23.5,38.1 23.5,40.64 26.67,41.59 29.21,41.59 31.11,41.59 31.11,44.45 31.11,46.99 31.11,49.53 31.11,52.07 31.11,54.61 31.11,57.15 31.11,59.69 31.11,62.23 29.84,63.82 25.72,63.82 27.94,63.82 25.72,62.23 25.72,60.33 25.72,58.42 27.94,58.42 29.21,57.15 29.21,55.56 28.89,52.39 24.77,52.7 23.5,51.12 39.37,60.96 39.37,59.69 39.37,58.42 39.37,57.15 38.1,53.34 38.1,52.07 38.1,46.35 40.01,46.99 40.32,45.4 39.69,43.5 38.1,44.45 39.37,45.72 51.44,27.3 54.29,24.77 54.29,22.86 39.69,31.11
  pour Bottom (isolate 0.61, no thermals): 0,88.9 12.7,88.9 12.7,83.82 22.86,83.82 22.86,93.98 93.98,93.98 93.98,6.35 81.28,6.35 81.28,10.16 71.12,10.16 71.12,0 0,0
  pour Top (no thermals): 76.52,64.77 77.79,64.77 77.79,68.9 81.6,72.71 81.6,78.11 87.31,78.11 87.31,80.33 80.64,80.33 79.38,81.6 79.38,87.95 80.33,88.9 80.33,91.44 77.15,91.44 77.15,87.95 78.11,87.95 78.11,82.23 76.52,82.23 76.52,78.11 80.01,78.11 80.01,73.34 76.52,73.34
  pour Top (no thermals): 70.33,13.97 70.33,42.39 80.17,42.39 80.17,13.97
  pour Top (no thermals): 6.67,57.78 8.89,57.78 8.89,58.58 10.16,58.58 10.16,54.93 9.53,54.93 9.53,53.34 7.78,53.34 6.51,54.61 6.51,57.63
  pour Top (no thermals): 6.35,64.29 10.32,64.29 10.79,64.29 10.79,60.64 7.3,60.64 6.35,61.59
  pour Top (no thermals): 11.27,65.88 11.27,72.23 7.62,72.23 7.62,65.88
  pour Top: 38.89,87 38.89,85.57 41.12,85.57 41.12,82.55 41.75,82.55 41.75,86.36 40.8,87.31 38.89,87.31
  pour Top (no thermals): 58.58,82.23 57.47,82.23 56.04,84.14 56.04,88.74 58.58,88.74
  pour Top: 31.59,75.41 31.59,79.69 31.59,80.49 36.67,80.49 36.67,84.93 34.77,84.93 34.13,84.93 27.62,78.42 27.62,75.41
  pour Top (no thermals): 56.52,60.33 56.52,64.77 57.31,64.77 57.31,66.99 53.66,66.99 53.66,62.39 55.09,62.39 55.09,60.33
  pour Top (no thermals): 68.1,47.94 70.17,47.94 70.17,51.91 69.37,51.91 69.37,62.55 66.04,62.55 66.04,49.85
  pour Top (no thermals): 8.89,51.44 18.41,51.44 18.41,46.35 20.95,46.35 20.95,51.44 23.81,51.44 23.81,53.34 29.53,53.34 29.53,54.61 27.62,54.61 27.62,58.1 25.4,58.1 25.4,64.14 31.43,64.14 31.43,40.96 24.13,40.96 24.13,22.54 19.05,22.54 19.05,36.51 18.41,36.51 18.41,37.78 20.95,37.78 20.95,45.72 18.41,45.72 18.41,41.27 10.79,41.27 8.89,43.18
  pour Top (no thermals): 4.76,72.39 4.76,53.98 6.99,51.75 6.99,41.91 10.16,38.73 16.51,38.73 16.51,28.26 14.61,28.26 14.61,25.72 16.51,25.72 16.51,21.59 16.19,21.59 16.19,21.59 1.27,21.59 1.27,72.39
  pour Top (no thermals): 16.43,23.29 17.39,22.33 17.39,21.06 18.18,21.06 18.18,22.33 18.98,23.29 24.09,23.29 24.09,21.53 18.82,21.53 18.82,20.58 19.46,20.58 19.46,20.42 18.82,20.42 18.82,20.1 19.62,20.1 19.62,19.94 18.82,19.94 18.82,18.66 18.98,18.5 38.53,18.5 38.53,15.79 20.41,15.79 arc-90 18.66,17.21 18.18,17.71 18.18,18.98 17.39,18.98 17.39,17.71 16.75,16.75 16.75,14.04 1.28,14.04 1.28,22.85 1.27,22.86 6.52,22.86 6.52,18.37 6.54,18.34 14.36,18.34 15.47,19.62 16.75,19.62 16.75,20.42 15.47,20.42 14.2,21.69 14.2,23.29
  pour Top (no thermals): 39.21,5.56 60.96,5.56 60.96,1.11 13.97,1.11 13.97,15.24 16.67,15.24 18.1,13.34 22.23,13.34 22.23,11.75 34.45,11.75 34.45,7.14 33.81,7.14 33.81,3.33 39.21,3.33
  pour Top (no thermals): 55.88,55.88 55.88,42.55 58.1,42.55 58.1,40.64 55.88,40.64 55.88,38.73 54.29,38.73 53.66,39.37 53.66,40.64 51.12,43.18 51.12,45.09 50.8,45.09 50.8,14.92 48.9,13.34 46.04,13.34 46.04,11.75 52.7,11.75 53.02,12.06 53.02,19.05 54.93,20.32 55.88,20.32 55.88,30.64 62.87,37.47 62.87,55.88
  pour Top (no thermals): 33.02,38.1 35.24,40.32 46.67,40.32 46.67,31.75 48.26,31.75 48.26,16.51 44.45,16.51 44.45,15.56 43.81,15.56 43.5,15.88 43.5,26.99 44.77,26.99 44.77,30.48 40.64,30.48 40.64,21.59 39.37,21.59 39.37,18.73 40.64,17.46 40.64,16.51 33.02,16.51
  pour Top (no thermals): 41.91,61.28 41.91,55.56 36.83,55.56 36.83,61.91 41.91,61.91
  pour Top (no thermals): 40.01,53.98 40.01,50.8 36.83,50.8 36.83,53.98
  pour Top (no thermals): 36.83,47.94 39.37,47.94 39.37,48.58 40.64,48.58 40.64,46.04 41.59,46.04 41.59,42.23 38.42,42.23 36.83,43.81
LED1
  Top 0.254: R39.1 47.83,84.66 47.78,84.61 47.7,84.53 U5.50
N$1
  Top 0.254: U3.41 12.18,61.71 12.06,61.59 C16.1
N$2
  Top 0.406: R8.1 X2.10
N$3
  Top 0.254: U2.11 53.05,45.06 53.34,44.77 C36.1
N$4
  Top 0.61: L7.1 28.57,14.61 | 28.57,14.61 C86.2 | C56.2 28.57,14.61
N$5
  Top 0.254: U5.8 35.61,77.72 arc-90 Q2.1 32.84,78.72 C13.1
N$6
  Top 0.254: U5.9 35.61,77.22 arc90 Q2.2 32.84,76.22 C14.1
N$7
  Top 0.406: U16.1
  Top 0.61: L6.1 U16.1
N$8
  Top 0.61: C9.1 L6.2
N$9
  Top 0.254: U3.31 20.07,65.47 20.64,66.04 21.91,67.31 C18.1
N$10
  Top 0.254: U3.11 22.57,56.49 22.86,56.2 24.45,56.2 25.08,56.83 26.24,56.83 C25.1
N$11
  Top 0.406: U12.3 77.31,83.18 77.15,83.03 75.57,83.03 75.41,82.87
  Top 0.61: C4.1 75.41,82.87 U12.1 | U1.6 75.56,78.78 C3.1
  Top 0.813: C4.1 75.45,80.92 C3.1 74.3,77.74 U1.7
N$12
  Top 0.406: U1.5 77.89,75.94 78.42,75.41 R1.2 | R1.2 78.42,74.3 R1.2
N$13  (via drill 0.3)
  Top 0.254: U5.7 40.76,78.22 v40.96,78.42
  Bottom 0.254: v40.96,78.42 42.23,79.06 42.55,79.06 C10.1
N$14
  Top 0.406: U16.4
  Top 0.61: C39.2 U16.4
N$15
  Top 0.406: L10.2 17.78,26.99 L10.2
  Top 0.61: C50.1 17.78,26.99 L9.1
N$16
  Top 0.61: F1.3 C2.2
N$17  (via drill 0.3)
  Top 0.254: v43.5,88.42 43.5,87.15 44.13,86.52 44.2,86.45 U5.57
  Bottom 0.254: X2.7 26.67,91.92 28.89,89.69 42.23,89.69 v43.5,88.42
N$18  (via drill 0.3)
  Top 0.254: v44.61,88.9 44.61,87 44.7,86.9 U5.56
  Bottom 0.254: X2.5 27.94,91.92 29.21,90.65 42.86,90.65 v44.61,88.9
N$19  (via drill 0.3)
  Top 0.254: v45.72,88.9 45.72,87.63 45.24,87.15 45.24,83.31 U5.55
  Bottom 0.254: X2.3 29.21,92.08 29.84,91.44 45.4,91.44 45.88,90.96 45.88,89.06 v45.72,88.9
N$20  (via drill 0.3)
  Top 0.254: v46.99,87.63 45.72,86.36 45.7,86.34 U5.54
  Bottom 0.254: X2.1 46.04,92.39 46.99,91.44 46.99,88.9 v46.99,87.63
N$21
  Top 0.254: U15.3 17.78,22.86
  Top 0.61: 17.78,22.86 L9.2
N$22
  Top 0.254: U3.48 14.91,58.21 C20.1
N$23
  Top 0.61: L7.2 26.04,14.61 | 26.04,14.61 25.24,14.61 L8.1 | C51.2 26.04,14.61
N$24
  Top 0.254: U3.8 21.07,54.81 21.59,54.29 24.45,54.29 26.35,52.39 R9.1
N$25
  Top 0.254: U3.10 22.07,55.72 22.23,55.56 R10.1
N$26
  Top 0.254: C21.2 R11.2
N$27
  Top 0.254: U2.48 46.46,46.78 45.52,46.79 | 45.52,46.79 45.4,46.67 45.52,46.79 | C31.1 45.52,46.79
N$28
  Top 0.254: U2.10 52.55,44.6 53.98,43.18 R13.2
N$29
  Top 0.254: C32.2 R14.2
N$30
  Top 0.254: U2.8 51.55,43.38 54.93,40.01 R12.2
N$31
  Top 0.254: U2.41 44.02,50.28 42.23,52.07 41.39,52.07 C27.1
N$32
  Top 0.254: U2.31 50.55,53.88 51.12,54.45 51.12,55.77 C29.1
N$33
  Top 0.254: 47.94,14.76 C80.1
  Top 0.305: R34.2 49.33,19.89 arc90 49.37,19.84 49.37,16.51 arc90 49.53,16.35
  Top 0.61: 47.94,14.76 arc90 49.53,16.35 L3.2 47.94,33.22 C42.1
N$34
  Top 0.254: U2.2 48.55,45.38 46.67,43.5 C32.1 45.2,44.7 C31.2
N$35
  Top 0.254: U3.2 18.07,56.49 17.46,55.88 15.12,55.88 | 15.12,55.88 C20.2 | C21.1 13.22,53.98 15.12,55.88
N$36
  Top 0.406: 49.33,38.1 L2.1
  Top 0.61: L2.1 C6.2 | C40.1 49.33,38.1
N$37
  Top 0.406: 49.53,35.56 L2.2
  Top 0.61: L3.1 49.53,35.56 | C41.1 49.53,35.56 | L2.2 49.53,35.56
N$38
  Top 0.254: R18.1 C47.1
N$39
  Top 0.254: U15.13 17.78,16.99
  Top 0.61: 17.78,16.99 17.78,16.35 arc90 19.53,14.61 23.18,14.61 | 23.18,14.61 L8.2 | C57.2 23.18,14.61
N$40
  Top 0.254: C44.1 R16.1
N$41
  Top 0.61: C39.1 F1.1
N$42
  Top 0.254: U4.4 28.73,35.73 29.84,34.61 29.84,34.41 C52.1 R6.2 30.16,31.75 30.16,31.11 arc-90 29.53,30.48 27.3,30.48 arc90 26.04,29.21 26.04,21.59 arc-90 23.45,19 U15.16
N$43
  Top 0.61: L10.1 C9.2
N$44
  Top 0.254: U15.17 23.31,19.5 arc90 25.4,21.59 25.4,31.55 arc-90 R19.2 C53.1 25.72,34.41 25.72,34.29 25.87,34.44 U6.4
N$45
  Top 0.254: R29.2 LED2.A
  cutout Bottom (no thermals): 5,88 5,81 13,81 13,88
  cutout Bottom (no thermals): 81,13 81,6 89,6 89,13
  cutout Bottom (no thermals): 5,13 5,5 13,5 13,13
  cutout Bottom (no thermals): 81,89 81,81 89,81 89,89
N$46
  Top 0.254: U15.8 14.76,20
  Top 0.61: 14.76,20 X5.1
N$47
  Top 0.254: U9.7 70.8,52.82 C65.1
  Top 0.406: C65.1 70.6,54.61 | 70.6,54.61 70.6,54.98 TR1.3 | R20.1 70.6,54.61
N$48
  Top 0.254: U5.49 51.36,83.27 51.59,83.5 R29.1
N$49
  Top 0.254: R39.2 LED1.A
N$50
  Top 0.61: U10.3 65.2,31.75 C63.1
N$51
  Top 0.406: TR1.1 71.44,60.44 R25.1
N$52
  pour Top (no thermals): 74.14,46.35 73.18,46.35 73.18,44.29 71.6,44.29 71.6,52.07 73.18,52.07 73.18,50.32 74.14,50.32 74.14,53.34 71.28,53.34 71.28,44.29 65.88,44.29 65.88,32.54 69.37,32.54 69.37,43.02 74.14,43.02
N$53
  Top 0.61: R22.2 R21.1 | U10.5 64.34,29.21 R21.1 | R21.1 63.41,29.41 R23.2
N$54
  Top 0.61: C64.2 R23.1
N$55
  Top 0.406: R24.2 68.58,46.04 69.22,45.4 69.96,45.4 U9.9
N$56
  Top 0.254: U5.35 58.21,74.72 62.23,78.74 63.5,80.01 X3.1
N$57
  Top 0.254: U5.34 58.98,74.22 66.04,81.28 X4.1
N$60
  Top 0.254: U5.29 46.7,70.14 46.99,69.85 48.26,68.58 52.07,68.58 52.39,68.26 R27.2
N$61
  Top 0.254: U5.31 47.7,70.41 48.26,69.85 52.07,69.85 54.49,69.85 R26.2
N$62
  Top 0.305: R33.2 31.86,26.87 32.38,26.35 32.38,24.13 31.75,23.49 U8.6
N$63
  Top 0.305: R32.2 28.46,26.87 26.99,25.72 26.99,24.45 28.26,23.49 U8.1
N$66
  Top 0.406: C79.1 14.29,67.35 TCXO3.3
N$68
  Top 0.406: C78.1 44.45,56.24 TCXO2.3
N$71
  Top 0.254: 32.5,12.81 C84.1
  Top 0.61: 31.59,14.61 C86.1 31.11,14.4 | 31.59,14.61 L11.2 | C85.1 32.5,12.81 32.54,12.86 31.75,12.86 31.75,14.45 31.59,14.61
N$72
  pour Top (no thermals): 41.79,15.63 41.79,16.59 41.63,16.75 41.63,16.75 41.31,17.07 41.31,18.34 42.43,18.34 42.59,18.18 42.59,16.75 42.43,16.59 42.43,15.63 42.27,15.63 42.27,16.27 41.95,16.27 41.95,15.63
N$73
  pour Top (no thermals): 42.7,14.92 42.7,14.76 44.13,14.76 45.56,14.45 46.67,14.45 46.67,15.24 45.56,15.24 44.13,14.92
N$75
  pour Top (no thermals): 40.48,15.4 40.48,13.81 40.01,13.81 39.69,14.13 33.5,14.13 33.5,15.08 39.69,15.08 39.85,15.24 40.01,15.4
N$79
  Top 0.61: L12.1 41.91,20.42 | 41.91,20.42 41.91,20.85 41.95,20.9 41.91,20.94 R35.2 | C93.1 41.81,20.32 41.91,20.42
N$80
  Top 0.305: U14.1 43.51,13.86 arc-45 43.69,13.78 44.61,13.02 R36.1
OBC_-FAULT  (via drill 0.3)
  Top 0.254: R5.2 26.24,72.82 26.67,72.39 v29.21,72.39
  Top 0.406: R5.2 26.24,75.13 26.35,75.25 R4.1
  Bottom 0.254: v29.21,72.39 36.83,72.39 41.91,77.47 45.72,77.47 47.31,79.06 52.07,79.06
  Bottom 0.305: 52.07,79.06 55.56,79.06 82.23,51.59 82.23,40.32 83.19,39.37 85.41,39.37 86.36,38.1 X1.34
OBC_-FAULT_IN
  Top 0.254: U5.12 36.35,75.72 34.29,73.66 27.94,73.66 R5.1
OBC_OFF
  Bottom 0.254: R7.2 55.4,80.49
  Bottom 0.305: 55.4,80.49 82.87,52.07 85.09,52.07 85.09,49.53 86.36,48.26 86.35,48.27 X1.26
OBC_OFF_OUT  (via drill 0.3)
  Top 0.254: U5.2 42.62,80.72 v43.18,81.28
  Bottom 0.254: v43.18,81.28 44.13,81.28 44.77,80.64 45.72,80.64 45.76,80.6 R7.1
PA_-FAULT
  Top 0.254: R28.2 70.64,47.31 70.8,47.15 U9.10 | U9.10 70.8,45.56 U9.10
PA_BIAS  (via drill 0.3)
  Top 0.254: U5.5 39.85,79.22 v40.64,80.01 | v66.04,72.39 66.04,68.58 v62.23,64.77 | v63.5,62.23 63.5,37.15 60.48,34.13 57.47,31.11 57.47,25.08 57.15,24.77 C67.1
  Top 0.406: C67.1 R38.1 R37.2 58.3,22.98 58.42,22.86 58.42,20.32 58.42,19.97 U11.3
  Bottom 0.254: v40.64,80.01 40.64,81.28 43.18,83.82 54.61,83.82 v66.04,72.39 | v62.23,64.77 62.23,63.5 v63.5,62.23
PA_ON  (via drill 0.3)
  Top 0.254: U5.40 v52.32,77.22 | v68.58,64.77 69.85,63.5 | 69.85,63.5 v68.58,64.77 | v68.58,64.77 69.85,63.5 | 69.85,63.5 71.12,62.23 71.12,62.19 R25.2
  Bottom 0.254: v52.32,77.22 55.88,73.66 59.69,73.66 v68.58,64.77
RX_ON  (via drill 0.3)
  Top 0.254: U6.2 26.37,38.12 27.3,39.05 28.26,40.01 31.43,40.01 32.38,40.96 32.38,62.87 32.38,64.77 v33.97,66.36 | v42.23,76.52 45.72,76.52 46.35,77.15 47.94,77.15 48.26,76.83 48.38,76.72 U5.39
  Bottom 0.254: v33.97,66.36 33.97,68.26 40.64,74.93 v42.23,76.52
TX_ON  (via drill 0.3)
  Top 0.254: U4.2 29.23,38.75 29.84,39.37 31.75,39.37 33.02,40.64 33.02,64.14 33.34,64.45 v35.24,66.36 | v42.23,75.25 46.04,75.25 46.99,76.2 47.62,76.2 47.65,76.22 U5.38
  Bottom 0.254: v35.24,66.36 35.24,68.26 v42.23,75.25
VAPC  (via drill 0.4)
  Top 0.254: C89.2 v42.7,11.91 42.34,12.27 U14.16 | U14.15 41.84,11.52 40.96,10.64
  Top 0.305: 40.96,10.48 41.07,10.59 C88.2 41.07,10.64 40.96,10.64
  Top 0.406: U11.1 57.47,17.46 55.88,19.05 55.53,19.05 U11.4 54.92,19.36 53.98,18.73 v53.98,15.24
  Top 0.61: C89.2 C88.2
  Bottom 0.406: v53.98,15.24 53.98,13.49 53.98,10.95 44.13,10.95 42.7,11.11 v42.7,11.91
VBAT
  Top 0.254: X1.11 83.82,66.04 86.36,66.04 X1.12
VBUS
  pour Top (no thermals): 87.31,67.63 82.55,67.63 81.28,66.04 79.69,64.14 79.69,46.83 74.77,46.83 74.77,44.77 74.45,44.77 74.45,46.83 72.87,46.83 72.87,44.77 72.07,44.77 72.07,51.59 72.87,51.59 72.87,49.69 74.45,49.69 74.45,57.15 72.71,57.15 72.71,71.75 74.61,71.75 74.61,62.55 78.42,62.55 78.42,68.42 81.44,71.44 87.31,71.6
VCCRF  (via drill 0.3, 0.6, 1)
  Top 0.254: U2.32 50.05,54.41 49.53,54.93 | 42.23,53.34 42.86,52.7 42.86,52.07 43.81,51.12 44.15,50.78 U2.40 | L1.2 47.83,43.7 48.26,44.13 49.05,44.92 U2.3 | C26.1 45.2,49.01 45.4,49.21 45.47,49.28 U2.43 | U2.9 52.07,46.01 52.07,43.81 54.29,41.59 v55.88,41.59 C35.1 | 49.53,54.93 50.16,54.93 v50.48,54.93 | v46.04,60.33 45.09,60.33 44.45,60.96 44.45,60.6 TCXO2.4 | C30.1 49.53,54.93 | U3.32 19.57,67.83 20.32,68.58 | C19.1 20.32,68.58 | 20.32,68.58 v20.32,67.31 | U3.3 18.57,53.93 C22.1 | U3.43 15.31,60.71 13.65,59.05 7.62,59.05 | 7.62,59.05 7.5,59.05 | U3.40 13.67,62.21 12.7,63.18 11.86,63.18 | U3.9 21.57,55.27 21.91,54.93 24.77,54.93 25.72,53.98 v27.15,53.98 C24.1 | 27.3,36.83 26.87,36.39 U6.5 | 29.73,36.63 29.53,36.83 27.3,36.83 | U15.20 24.18,21 arc90 24.77,21.59 24.77,35.88 arc-90 25.72,36.83 27.3,36.83 | 29.73,36.63 30.28,36.63 30.48,36.83 30.48,38.1 v30.8,38.42 | v35.56,41.91 36.83,41.91 36.99,42.07 | v30.16,27.62 30.16,26.35 30.91,25.6 C66.1 30.91,25.2 30.8,25.08 | C17.1 7.42,58.85 7.62,59.05 | C28.1 41.27,53.34 | U4.5 29.73,36.63
  Top 0.305: 31.11,25.4 30.8,25.08 30.48,24.77 30.48,21.91 30.8,21.59 U8.4
  Top 0.406: C74.1 13.77,72.23 TCXO3.4 14.48,71.63 | C75.1 43.93,61.12 TCXO2.4 | C26.1 36.08,49.01 35.56,49.53 | 42.23,53.34 41.27,53.34 41.27,53.66 40.64,54.29 40.01,54.93 35.56,54.93 | C22.1 C23.1 8.05,52.5 | 7.5,59.05 7.5,59.8 6.67,60.64 5.71,60.64 | 5.71,64.77 11.43,64.77 11.86,64.34 11.86,63.18 C15.1 | U16.6 15.63,39.62 C11.1
  Top 0.61: C55.1 59.21,60.96 L13.2 | C75.1 43.93,65.29 43.18,66.04 39.37,66.04 v38.1,64.77 | C34.1 C33.1 C37.1 C38.1 47.42,41.39 47.94,41.91 47.94,42.75 L1.2 | C11.1 12.7,40.01 C12.P$1 12.66,40.01 10.48,40.01
  Top 0.813: C34.1 37.67,41.39 37.62,41.43 | C22.1 C23.1 8.05,52.5 | 8.05,52.5 7.5,52.5 5.71,54.29 5.71,60.64 5.71,64.77 5.71,72.39 8.26,74.93 18.1,74.93 | 8.05,52.5 8.05,42.43 10.48,40.01
  Top 1.016: C55.1 57.58,58.85 v57.15,58.42 | v38.1,64.77 35.56,62.23 35.56,54.93 35.56,49.53 35.56,43.5 36.99,42.07 37.62,41.43 37.78,41.27 | 14.48,71.63 17.78,74.93 18.1,74.93 v22.86,74.93
  Bottom 0.254: v50.48,54.93 50.48,55.88 v46.04,60.33 | 22.86,73.66 21.59,73.66 20.32,72.39 20.32,69.85 v20.32,67.31 22.7,67.31 24.61,65.41 24.61,57.78 27.15,55.24 v27.15,53.98 | v35.56,41.91 32.07,38.42 v30.8,38.42 30.48,38.1 30.16,37.78 v30.16,27.62 | v55.88,41.59 54.93,41.59 54.61,41.91 54.61,57.15 55.88,58.42
  Bottom 1.016: v57.15,58.42 55.88,58.42 54.61,58.42 52.07,60.96 46.99,66.04 39.37,66.04 v38.1,64.77 31.75,64.77 26.67,68.58 22.86,72.39 22.86,73.66 v22.86,74.93
VCOMMS_PA  (via drill 0.3)
  Top 0.254: U14.14 41.34,12.61 40.64,11.91 39.85,11.11 39.85,6.83 40.01,6.67
  Top 0.305: 42.02,28.12 42.09,28.12 43.18,29.21 43.12,29.21 C90.P$1
  Top 0.406: R37.1 63.5,22.86 66.04,20.32 | U11.5 55.45,17.23 C68.1 55.45,13.13 55.88,12.7
  Top 0.61: U10.7 67.19,26.55 R22.1 63.18,25.6 C64.1 | R35.1 41.91,24.17 C91.1 C92.1 42.02,28.12
  Top 0.8: C94.1 43.77,6.78 43.81,6.83 C95.1 C96.1 | C96.1 C87.2 49.96,6.78 55.88,12.7 | R36.2 44.61,7.58 C96.1
  Top 0.813: C90.P$1 v44.45,28.89 | v60.33,28.89 60.33,24.77 60.96,24.13 67.31,24.13
  Bottom 0.813: v44.45,28.89 51.75,28.89 52.07,28.89 v60.33,28.89
  pour Top (no thermals): 65.88,28.26 65.88,22.54 56.99,13.65 54.61,13.65 54.61,10.32 65.41,10.32 69.06,13.81 69.06,28.26
  pour Top (no thermals): 66.52,11.27 46.67,11.27 46.67,6.35 61.12,6.35
  pour Top (no thermals): 35.08,3.97 35.08,12.38 38.58,12.38 38.58,7.46 46.99,7.46 46.99,6.35 38.58,6.35 38.58,3.97
VSOLAR
  Top 0.254: X1.5 83.82,73.66 86.36,73.66 X1.6

## Text on the board
tPlace: RXD | TXD | GND